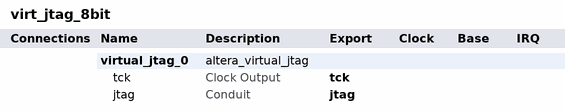
[diagram p0: system contents]
# Platform Designer (Qsys) system virt_jtag_8bit, Cyclone IV GX EP4CGX150DF31C7
# Parameters at their usual value, and those the tool derives, are not listed.
package require -exact qsys 14.0
create_system virt_jtag_8bit
set_project_property DEVICE_FAMILY {Cyclone IV GX}
set_project_property DEVICE EP4CGX150DF31C7

add_instance virtual_jtag_0 altera_virtual_jtag 14.0
set_instance_property virtual_jtag_0 AUTO_EXPORT true
set_instance_parameter_value virtual_jtag_0 device_family {Cyclone IV GX}
set_instance_parameter_value virtual_jtag_0 gui_use_auto_index false
set_instance_parameter_value virtual_jtag_0 sld_instance_index 1
set_instance_parameter_value virtual_jtag_0 sld_ir_width 3
set_instance_parameter_value virtual_jtag_0 CREATE_PRIMITIVE_JTAG_STATE_SIGNAL_PORTS false

# exported interfaces
add_interface jtag conduit end
set_interface_property jtag EXPORT_OF virtual_jtag_0.jtag
add_interface tck clock source
set_interface_property tck EXPORT_OF virtual_jtag_0.tck

set_interconnect_requirement {$system} qsys_mm.clockCrossingAdapter HANDSHAKE
set_interconnect_requirement {$system} qsys_mm.maxAdditionalLatency 1
set_interconnect_requirement {$system} qsys_mm.insertDefaultSlave FALSE

save_system virt_jtag_8bit.qsys
